# Altium schematic sheet Schemamicro2.SchDoc
size A4; SheetNumber: 2; SheetTotal: 2
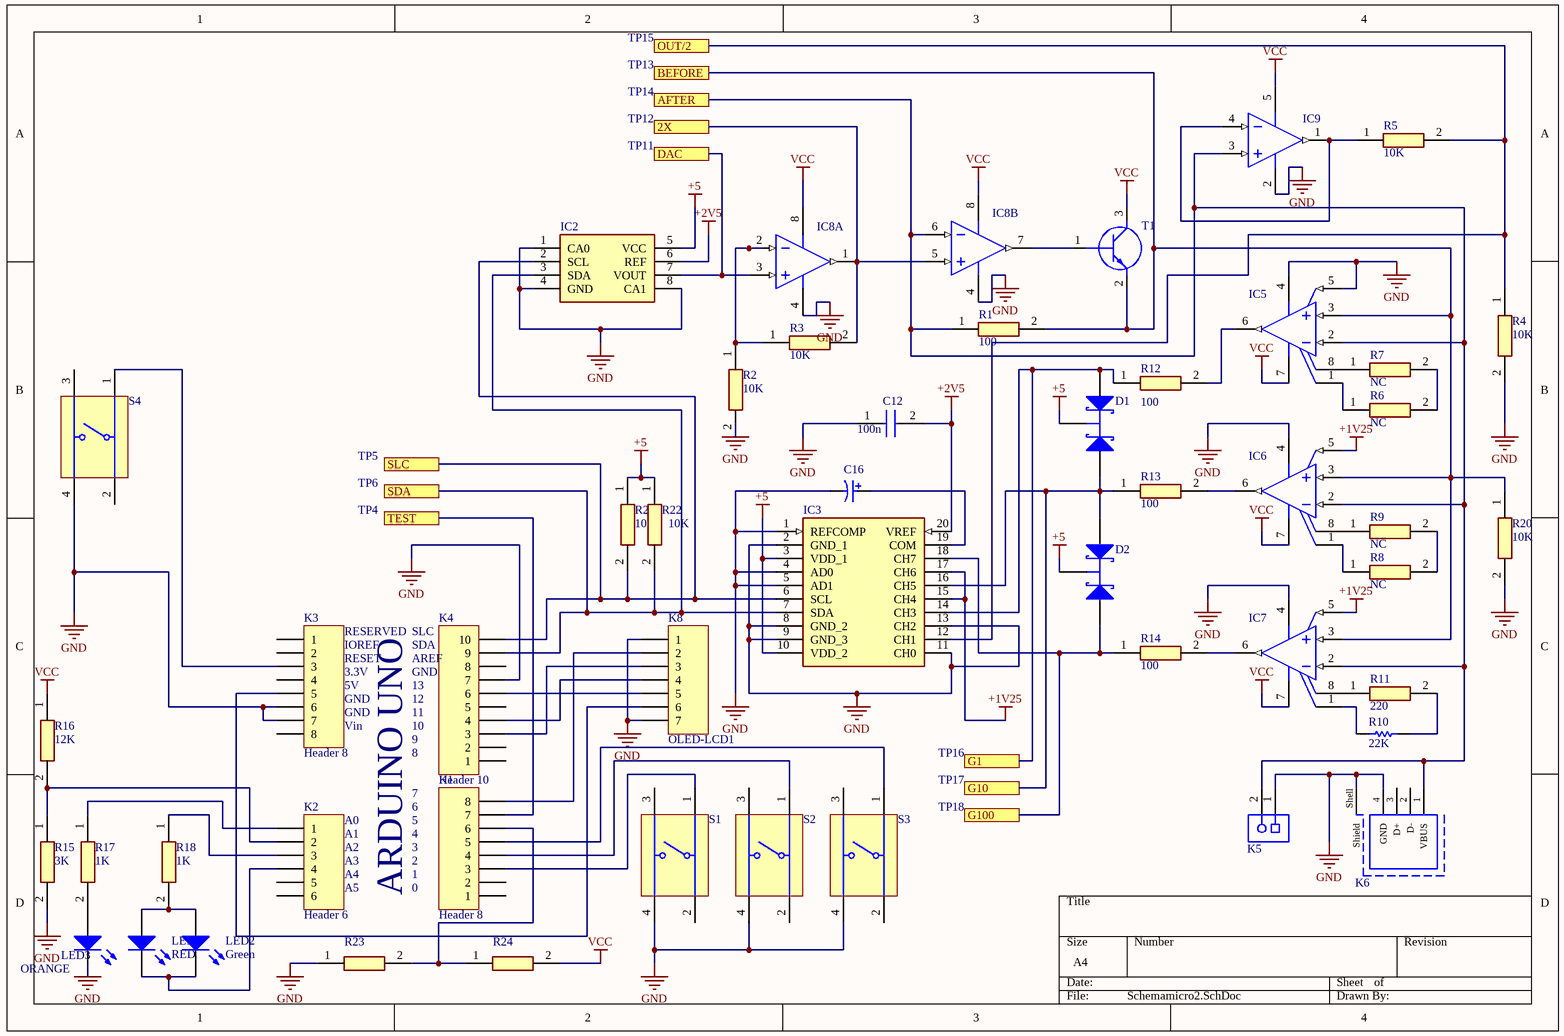
[diagram p0: Schemamicro2.SchDoc]

## Parts
C12  100n  [CAPC2012X90N]
C16  (no value)  [KEMT-T491-B_L]
D1  (no value)  [NXP-SOT23-3_V]
D2  (no value)  [NXP-SOT23-3_V]
IC2  (no value)  [SOT65P280X100-8N]
IC3  (no value)  [SOP65P640X110-20N]
IC5  (no value)  [LT-S8-8_M]
IC6  (no value)  [LT-S8-8_N]
IC7  (no value)  [LT-S8-8_N]
IC8  (no value)  [LT-S8-8_M]  (parts A,B of 2)
IC9  (no value)  [LT-S5-5-TSOT-23_L]
K1  Header 8  [HDR1X8]
K2  Header 6  [HDR1X6]
K3  Header 8  [HDR1X8]
K4  Header 10  [HDR1X10]
K5  (no value)  [PHOE-1729128-2_V]
K6  (no value)  [61400416021]
K8  OLED-LCD1  [HDR1X7]
LED1  RED  [1206_A]
LED2  Green  [1206_A]
LED3  ORANGE  [1206_A]
R1  100  [RESC2012X65N]
R2  10K  [RESC2012X65N]
R3  10K  [RESC2012X65N]
R4  10K  [RESC2012X65N]
R5  10K  [RESC2012X65N]
R6  NC  [RESC2012X65N]
R7  NC  [RESC2012X65N]
R8  NC  [RESC2012X65N]
R9  NC  [RESC2012X65N]
R10  22K  [RESC2013X60X40ML20T25]
R11  220  [RESC2012X65N]
R12  100  [RESC2014X65N]
R13  100  [RESC2014X65N]
R14  100  [RESC2014X65N]
R15  3K  [RESC2014X65N]
R16  12K  [RESC2014X65N]
R17  1K  [RESC2014X65N]
R18  1K  [RESC2014X65N]
R20  10K  [RESC2014X65N]
R21  10K  [RESC2014X65N]
R22  10K  [RESC2014X65N]
R23  (no value)  [RESC2014X65N]
R24  (no value)  [RESC2014X65N]
S1  (no value)  [TECO-1825910-6_V]
S2  (no value)  [TECO-1825910-6_V]
S3  (no value)  [TECO-1825910-6_V]
S4  (no value)  [TECO-1825910-6_V]
T1  (no value)  [SOT95P230X110-3N]

## Ports
2X, AFTER, BEFORE, DAC, G1, G10, G100, OUT/2, SDA, SLC, TEST

## Nets
+1V25: IC3.15(CH4) IC3.17(CH6) IC6.5(REF) IC7.5(REF)
+2V5: C12.2 IC2.6(REF) IC3.20(VREF)
+5: D1.3(K) D2.3(K) IC2.5(VCC) IC3.3(VDD_1) IC3.10(VDD_2) R21.1 R22.1
GND: C12.1 C16.2 IC2.1(CA0) IC2.4(GND) IC2.8(CA1) IC3.1(REFCOMP) IC3.2(GND_1) IC3.4(AD0) IC3.5(AD1) IC3.8(GND_2) IC3.9(GND_3) IC3.11(CH0) IC3.13(CH2) IC5.4(-VS) IC5.5(REF) IC6.4(-VS) IC7.4(-VS) IC8.4(V-) IC9.2(V-) K3.6 K3.7 K4.7 K5.1 K6.4(GND) K6.Shell(Shield) K8.1 K8.7 LED3.1(K) R2.2 R4.2 R15.2 R20.2 R23.1 S1.4 S2.4 S3.4 S4.4
VCC: IC5.7(+VS) IC6.7(+VS) IC7.7(+VS) IC8.8(V+) IC9.5(V+) R16.1 R24.2 T1.3(C)
2X: IC8.1(OUT_A) IC8.5(+IN_B) R3.2 ; port 2X
AFTER: IC5.2(-IN) IC6.2(-IN) IC7.2(-IN) IC8.6(-IN_B) IC9.3(+IN) K5.2 K6.1(VBUS) R1.1 ; port AFTER
BEFORE: IC5.3(+IN) IC6.3(+IN) IC7.3(+IN) R1.2 R20.1 T1.2(E) ; port BEFORE
DAC: IC2.7(VOUT) IC8.3(+IN_A) ; port DAC
G1: D1.2(A) IC3.14(CH3) R12.1 ; port G1
G10: D1.1(A) D2.2(A) IC3.16(CH5) R13.1 ; port G10
G100: D2.1(A) IC3.18(CH7) R14.1 ; port G100
OUT/2: IC3.12(CH1) R4.1 R5.2 ; port OUT/2
SDA: IC2.3(SDA) IC3.7(SDA) K4.9 R22.2 ; port SDA
SLC: IC2.2(SCL) IC3.6(SCL) K4.10 R21.2 ; port SLC
TEST: K1.7 ; port TEST
NetC16_1: C16.1 IC3.19(COM)
NetIC5_1: IC5.1(RG) R6.1
NetIC5_6: IC5.6(OUT) R12.2
NetIC5_8: IC5.8(RG) R7.1
NetIC6_1: IC6.1(RG) R8.1
NetIC6_6: IC6.6(OUT) R13.2
NetIC6_8: IC6.8(RG) R9.1
NetIC7_1: IC7.1(RG) R10.1
NetIC7_6: IC7.6(OUT) R14.2
NetIC7_8: IC7.8(RG) R11.1
NetIC8_2: IC8.2(-IN_A) R2.1 R3.1
NetIC8_7: IC8.7(OUT_B) T1.1(B)
NetIC9_1: IC9.1(OUT) IC9.4(-IN) R5.1
NetK1_3: K1.3 S1.1
NetK1_4: K1.4 S2.1
NetK1_5: K1.5 S3.1
NetK1_6: K1.6 R23.2 R24.1
NetK1_8: K1.8 K8.2
NetK2_1: K2.1 R17.1
NetK2_2: K2.2 R15.1 R16.2
NetK2_3: K2.3 R18.1
NetK2_4: K2.4 LED1.1(K) LED2.1(K)
NetK3_3: K3.3 S4.1
NetK3_5: K3.5 K8.6
NetK4_3: K4.3 K8.3
NetK4_4: K4.4 K8.4
NetK4_6: K4.6 K8.5
NetLED1_2: LED1.2(A) LED2.2(A) R18.2
NetLED3_2: LED3.2(A) R17.2
NetR6_2: R6.2 R7.2
NetR8_2: R8.2 R9.2
NetR10_2: R10.2 R11.2

Not connected (* = marked no-connect by the designer): K1 1 2; K2 5 6; K3 1 2 4 8; K4 1 2 5 8; K6 2(D-) 3(D+); S1 2 3; S2 2 3; S3 2 3; S4 2 3

## Notes on the sheet
- TP15
- TP14
- TP13
- TP11
- TP12
- TP5
- TP6
- TP4
- (near K3) RESERVED
- (near K3) IOREF
- (near K4) SLC
- (near K4) SDA
- (near K3) RESET
- (near K3) 3.3V
- (near K3) 5V
- (near K3) GND
- (near K4) AREF
- (near K4) GND
- 13
- 12
- 11
- (near K3) Vin
- 10
- 9
- 8
- TP16
- TP17
- (near K2) A0
- (near K2) A1
- (near K2) A2
- 7
- 6
- 5
- 4
- 3
- TP18
- (near K2) A3
- (near K2) A4
- (near K2) A5
- ARDUINO UNO
- 2
- 1
- 0

## Library data of the parts
C12 = MC0805B104K500CT: Capacitor; Manufacturer_Name: MULTICOMP; Datasheet Link: https://componentsearchengine.com/Datasheets/2/MC0805B104K500CT.pdf; Height: 0.9mm; Manufacturer_Part_Number: MC0805B104K500CT
C16 = CMP-2000-07192-1: Tantalum Surface Mount Capacitor, 10 uF, +/- 20%, 16 V, -55 to 125 degC, 2-Pin SMD, RoHS, Tape and Reel; Manufacturer: Kemet; DF: 6%; Product Diameter (mm): NotRequiredmm; ESR: 2.8ohm; Capacitance: 10000000pF; Insulation: NotRequired; Rad Hardened: No; Polarity: Polar; Case Style: Molded; Product Depth (mm): 2.8mm; Product Length (mm): 3.5mm; Voltage: 16VDC; DCL: 1.6uA; Product Height (mm): 1.9mm; Mounting Technology: SurfaceMount; Package Reference: T491-B; Datasheet URL: http://www.kemet.com/Lists/ProductCatalog/Attachments/254/KEM_T2005_T491.pdf; Construction: SMTChip; Package / Case: 3528-21; Length W/Weld: NotRequiredmm; Seated Plane Height: NotRequiredmm; Datasheet Version: 06/2016; Seal: NotRequired; Mounting Style: SurfaceMount; Failure Rate: NotRequired; Operating Temp Range: -55Cto125C; Manufacturer URL: http://www.kemet.com/; Tolerance (+ or -): 20%; Case Code: B; Packaging: TapeandReel; Lead Spacing (nom): NotRequiredmm; Length W/Weld (max): NotRequiredmm; Package Description: 2-Pin Surface Mount Device, Body 3.5 x 2.8 mm; Wire Form: NotRequired
D1 D2 = CMP-0417-00003-1: Schottky Barrier Diode, 30 V, 2 uA, -55 to 150 degC, 3-Pin SOT23, RoHS, Tape and Reel; PartNumber: BAT54C; Manufacturer: NXP Semiconductors; IR (uA): 2; VF (mV): 800; Trr (ns): 5; Cd (pF): 10; VR (V): 30; Rth(j-a) (K/W): 500; RoHS: TRUE; Packing: Tape and Reel; ComponentLink2URL: http://www.nxp.com/documents/data_sheet/BAT54_SER.pdf; ComponentLink2Description: Datasheet; Temperature Range: -55 to 150 degC; PackageReference: SOT23-3; PackageDescription: 3-Pin Plastic Surface-mounted Package, Body 1.3 x 2.9 mm, Pitch 0.95 mm; Mounting Technology: Surface Mount; ComponentLink1URL: http://www.nxp.com/; DatasheetVersion: Rev. 5; ComponentLink1Description: Manufacturer URL
IC2 = LTC2631CTS8-LZ12#TRMPBF: Integrated Circuit; Manufacturer_Name: Analog Devices; Datasheet Link: https://www.analog.com/media/en/technical-documentation/data-sheets/2631fd.pdf; Height: 1mm; Manufacturer_Part_Number: LTC2631CTS8-LZ12#TRMPBF; Mouser Part Number: 584-2631CTS8LZ12TMPF; Mouser Price/Stock: https://www.mouser.co.uk/ProductDetail/Analog-Devices/LTC2631CTS8-LZ12TRMPBF/?qs=hVkxg5c3xu%252BAZArayp8N8g%3D%3D; Arrow Part Number: LTC2631CTS8-LZ12#TRMPBF; Arrow Price/Stock: https://www.arrow.com/en/products/ltc2631cts8-lz12trmpbf/analog-devices
IC3 = LTC2309CF#PBF: Integrated Circuit; Manufacturer_Name: Linear Technology; Datasheet Link: http://docs-emea.rs-online.com/webdocs/10c2/0900766b810c2cad.pdf; Height: 1.1mm; Manufacturer_Part_Number: LTC2309CF#PBF; Mouser Part Number: 584-LTC2309CF#PBF; Mouser Price/Stock: https://www.mouser.com/Search/Refine.aspx?Keyword=584-LTC2309CF%23PBF; Arrow Part Number: LTC2309CF#PBF; Arrow Price/Stock: https://www.arrow.com/en/products/ltc2309cfpbf/linear-technology
IC5 = CMP-0359-03660-2: Single Channel, Micropower, Single Supply Rail-to-Rail Output Instrumentation Amplifiers, 0.06 MHz Typical GBW, 0.026 V/us Typical SR, 2.2 to 36 V, 8-Pin SOIC (S8-8), Commercial, Pb-Free; Manufacturer: Linear Technology; PartNumber: LT1789CS8-1#PBF; Linear Technology Part Number: LT1789-1; Vos (mV) Typical: 0.15; Vs Max (V): 36; Vos (mV) Guaranteed: 0.75; Is (mA) Typical: 0.067; SR (V/us) Typical: 0.026; Vs Min (V): 2.2; Channels (#): 1; GBW (MHz) Typical: 0.06; PackageVersion: Rev G; ComponentLink1URL: http://www.linear.com/; ComponentLink2URL: http://cds.linear.com/docs/en/datasheet/1789fc.pdf; RoHS: Pb-Free; Mounting Technology: Surface Mount; RevisionNote: URLs updated; ComponentLink3URL: http://cds.linear.com/docs/en/packaging/05081610_G_SO8.pdf; DatasheetVersion: Rev. C; ComponentLink3Description: Package Specification; ComponentLink2Description: Datasheet; ComponentLink1Description: Manufacturer URL; Type: IA; PackageDescription: 8-Pin Plastic Small Outline, Body 4.9 x 3.9 mm, Pitch 1.27 mm; PackageReference: LT-S8-8
IC6 IC7 = CMP-0359-03644-3: Single Channel, Micropower, Single Supply Rail-to-Rail Output Instrumentation Amplifiers, 0.06 MHz Typical GBW, 0.026 V/us Typical SR, 2.2 to 36 V, 8-Pin SOIC (S8-8), Commercial, Pb-Free; PartNumber: LT1789CS8-10#PBF; Manufacturer: Linear Technology; Linear Technology Part Number: LT1789-10; Vos (mV) Typical: 0.65; SR (V/us) Typical: 0.026; GBW (MHz) Typical: 0.06; Channels (#): 1; Is (mA) Typical: 0.067; Vs Max (V): 36; Vos (mV) Guaranteed: 3; Vs Min (V): 2.2; PackageDescription: 8-Pin Plastic Small Outline, Body 4.9 x 3.9 mm, Pitch 1.27 mm; Mounting Technology: Surface Mount; ComponentLink1URL: http://www.linear.com/; DatasheetVersion: Rev. C; ComponentLink2Description: Datasheet; RoHS: Pb-Free; ComponentLink3Description: Package Specification; Type: IA; PackageReference: LT-S8-8; RevisionNote: URLs updated; ComponentLink1Description: Manufacturer URL; ComponentLink2URL: http://cds.linear.com/docs/en/datasheet/1789fc.pdf; ComponentLink3URL: http://cds.linear.com/docs/en/packaging/05081610_G_SO8.pdf; PackageVersion: Rev G
IC8 = CMP-0359-02698-2: Dual Channel, Low Noise, CMOS Operational Amplifier, RRO, 18 MHz Typical GBW, 10 V/us Typical SR, 2.8 to 12 V, 8-Pin SOIC (S8-8), Commercial, Pb-Free; Linear Technology Part Number: LTC6241HV; PartNumber: LTC6241HVCS8#PBF; Manufacturer: Linear Technology; SR (V/us) Typical: 10; Vs Min (V): 2.8; Is (mA) Typical: 1.8; Channels (#): 2; GBW (MHz) Typical: 18; Vos (mV) Typical: 0.04; Vs Max (V): 12; Type: VFB; RoHS: Pb-Free; ComponentLink3Description: Package Specification; DatasheetVersion: Rev. E; ComponentLink1Description: Manufacturer URL; RevisionNote: URLs updated; ComponentLink2Description: Datasheet; ComponentLink3URL: http://cds.linear.com/docs/en/packaging/05081610_G_SO8.pdf; Mounting Technology: Surface Mount; PackageDescription: 8-Pin Plastic Small Outline, Body 4.9 x 3.9 mm, Pitch 1.27 mm; PackageVersion: Rev G; ComponentLink2URL: http://cds.linear.com/docs/en/datasheet/624012fe.pdf; PackageReference: LT-S8-8; ComponentLink1URL: http://www.linear.com/
IC9 = CMP-0359-02161-2: Single Channel, Micropower Zero-Drift Operational Amplifier, 0.5 MHz Typical GBW, 0.5 V/us Typical SR, 2.7 to 11 V, 5-Pin SOT23 (S5-5), Commercial, Pb-Free, Mini Reel; PartNumber: LTC2054HVCS5#TRMPBF; Linear Technology Part Number: LTC2054HV; Manufacturer: Linear Technology; Vs Min (V): 2.7; Vos (mV) Typical: 0.0005; SR (V/us) Typical: 0.5; Channels (#): 1; Vs Max (V): 11; Is (mA) Typical: 0.15; ComponentLink1URL: http://www.linear.com/; ComponentLink1Description: Manufacturer URL; Packing: Mini Reel; PackageReference: LT-S5-5-TSOT-23; ComponentLink3URL: http://cds.linear.com/docs/en/packaging/SOT_5_05-08-1635.pdf; Type: ZD; PackageDescription: 5-Lead Plastic TSOT-23, Body 1.63 x 2.90 mm, Pitch 0.95 mm; RoHS: Pb-Free; RevisionNote: URLs updated; ComponentLink2URL: http://cds.linear.com/docs/en/datasheet/20545fc.pdf; Code_JEDEC: MO-193; GBW (MHz) Typical: 0.5; DatasheetVersion: Rev. C; Mounting Technology: Surface Mount; ComponentLink2Description: Datasheet; ComponentLink3Description: Package Specification
K1 K3 = Header 8: Header, 8-Pin; LatestRevisionDate: 17-Jul-2002; LatestRevisionNote: Re-released for DXP Platform.; Publisher: Altium Limited
K2 = Header 6: Header, 6-Pin; LatestRevisionDate: 17-Jul-2002; LatestRevisionNote: Re-released for DXP Platform.; Publisher: Altium Limited
K4 = Header 10: Header, 10-Pin; LatestRevisionDate: 17-Jul-2002; LatestRevisionNote: Re-released for DXP Platform.; Publisher: Altium Limited
K5 = CMP-2000-05815-1: PCB Terminal Block, 13.5 A, 400 V, 2-Pin THD, RoHS, Bulk; PartNumber: 1729128; Manufacturer: Phoenix Contact; Package Version: 03/2015; No. of Rows: 1; Pitch: 5.08mm; No. of Positions: 2; Voltage Rating: 400V; Current Rating: 13500mA; Manufacturer URL: http://www.phoenixcontact.com/; Datasheet URL: https://datasheet.ciiva.com/16046/1729128-16046181.pdf; RoHS: TRUE; Package URL: https://www.phoenixcontact.com/online/portal/pi/pxc/product_detail_page/!ut/p/b1/3VdJjqNKFDxLH8AFycySyWY2ozFsEPOMMQaDOX1XedGL_1Vdm5YXJleknhSKeBkvI6EA8ncAo3AYoDhBQGco6KN7VURTdemj9us_IEKEZo_YHiPAEWEFmDGOHMORkqKYCORBZxgL7ZoaZYcbFFUZ3fqxSY6GOuxydWUuHqz1ynmMFygu583Bob0Ewr6Sd_l-5m-kAueHiB0jpRwZwe58wwtkpxtMYd_LmGcDRU02dRNEyWt6Y2ti5pSyJ_reIkzIulrqApdnbT11V5jnCKbYNCvhEM1MCpPByat_X379-iThf08CI5GfOPqfBeS3BRoBOdD55AKVv0iLwCMq-2BrzXWSGRH7pUGD9uwXQjiph3xL0DKQwdGa0JImiIOmBNOestqgwTHSSs2oOep-78apyXQBvNi8ZLaFjvjWvcaUEBu0MC6Wbe-d6mB0FAebo2lUWinqYaZs5DAYzV0RP9yitUjnGJ0iI9xhZkT42OCQNUJJhkgWINNQLP2JFP6OpMg3JCVg70jqHT0lvKOnhHf0lPuOnnLf0VPuWx6_dxwUIvwk5WMkT0kLL1mh61l2yZVSzG3pYV_bqo-mj6uMKwKwdnnW8Jh5RTOJzMOA5c-eJDaZQw4mTMPH02PvS_ZAqNVjVTo2WyYLkwH_KU1mmmG5kjRhDqPXLwwVHvVOjCM60-fpXvTDfMGW1PVFVS1r4e4yVDk4ZdNbkUHvqPqQSeian4UD39fNKmachqdJ1NJbyk8rXT9mXTvPk3oE5meulKGgiruPJek-4I9hTT6G8ZLOyRSm2RRVbThERQad5OS28hdt4YW4vG0stgYYzsWsK4_7y6DZMjJSCqri1kyiZR5vD7pwIrNR7QwPHTcLTI5qT7eRlpHrdGiupYlqQDJ7zy_CND8fWWBoLRXxk1RVcXiBQwbTD4Xi7KL-FuO94t9xaqweXzH; Package Description: 2-Pin Through Hole Device, Body 8.1 x 10.16 mm, Pitch 5.08 mm; Datasheet Version: 12/2013; Mounting Technology: ThroughHole; Orientation: Horizontal; Package Reference: 1729128-2; Packing: Bulk
K6 = CMP-1502-03227-1: USB 2.0 Type A Receptacle WR-COM, Horizontal, THT; Manufacturer: Wurth Elektronik; Working Voltage: 30VAC; Rated Current: 1.5A; Contact Resistance: 20mOhm; Manufacturer URL: http://www.we-online.de; Publisher: WurthElektronik; Packaging: Tray; Operating Temperature: -40to105degC; Orientation: Horizontal; Mounting Technology: THT; Part Number: 61400416021; Gender: Receptacle; Package Reference: 61400416021; Connector Type: USB2.0TypeA; Datasheet URL: https://katalog.we-online.de/em/datasheet/61400416021.pdf
K8 = Header 7: Header, 7-Pin; LatestRevisionDate: 17-Jul-2002; LatestRevisionNote: Re-released for DXP Platform.; Publisher: Altium Limited
LED1 = CMP-1426-00013-1: SMD mono-color Chip LED, WL-SMCW, Red; PartNumber: 150120RS75000; Manufacturer: Wuerth Elektronik; Color: Red; ComponentLink2URL: http://katalog.we-online.com/led/datasheet/150120RS75000.pdf; ComponentLink2Description: Datasheet; ComponentLink1Description: Manufacturer URL; ComponentLink1URL: http://www.we-online.com; PackageReference: 1206_A
LED2 = CMP-1426-00014-1: SMD mono-color Chip LED, WL-SMCW, Green; Manufacturer: Wuerth Elektronik; PartNumber: 150120GS75000; PackageReference: 1206_A; ComponentLink1Description: Manufacturer URL; ComponentLink2URL: http://katalog.we-online.com/led/datasheet/150120GS75000.pdf; ComponentLink2Description: Datasheet; Color: Green; ComponentLink1URL: http://www.we-online.com
LED3 = CMP-1426-00019-1: SMD mono-color Chip LED, WL-SMCW, Yellow; PartNumber: 150120YS75000; Manufacturer: Wuerth Elektronik; ComponentLink2URL: http://katalog.we-online.com/led/datasheet/150120YS75000.pdf; ComponentLink1URL: http://www.we-online.com; Color: Yellow; ComponentLink1Description: Manufacturer URL; PackageReference: 1206_A; ComponentLink2Description: Datasheet
R1 R6-R9 = MCTC0525B1000T5E: Resistor; Manufacturer_Name: MULTICOMP; Datasheet Link: https://componentsearchengine.com/Datasheets/2/MCTC0525B1001T5E.pdf; Height: 0.65mm; Manufacturer_Part_Number: MCTC0525B1000T5E
R2-R5 = MCTC0525B1002T5E: Resistor; Manufacturer_Name: MULTICOMP; Datasheet Link: https://componentsearchengine.com/Datasheets/2/MCTC0525B1001T5E.pdf; Height: 0.65mm; Manufacturer_Part_Number: MCTC0525B1002T5E
R10 = CMP-2001-00614-1: Manufacturer: Panasonic; Part Number: ERA6AEB223V
R11 = MCTC0525B1000T5E: Resistor 220 ohm; Manufacturer_Name: MULTICOMP; Datasheet Link: https://componentsearchengine.com/Datasheets/2/MCTC0525B1001T5E.pdf; Height: 0.65mm; Manufacturer_Part_Number: MCTC0525B1000T5E
R12-R14 = MC01W08055100R: Resistor; Manufacturer_Name: MULTICOMP; Datasheet Link: http://www.farnell.com/datasheets/1729047.pdf; Height: 0.65mm; Manufacturer_Part_Number: MC01W08055100R
R15 R16 = MC01W0805512K: Resistor; Manufacturer_Name: MULTICOMP; Datasheet Link: http://www.farnell.com/datasheets/1729047.pdf; Height: 0.65mm; Manufacturer_Part_Number: MC01W0805512K
R17 R18 = MC01W080551K: Resistor 1K ohm; Manufacturer_Name: MULTICOMP; Datasheet Link: http://www.farnell.com/datasheets/1729047.pdf; Height: 0.65mm; Manufacturer_Part_Number: MC01W080551K
R20-R24 = MC01W0805510K: Resistor; Manufacturer_Name: MULTICOMP; Datasheet Link: http://www.farnell.com/datasheets/1729047.pdf; Height: 0.65mm; Manufacturer_Part_Number: MC01W0805510K
S1-S4 = CMP-1684-00021-1: Tact Switch, SPST-NO, 0.05 A, -35 to 85 degC, 4-Pin THD, RoHS, Bulk; Part No: 1825910-6; Manufacturer: TE Connectivity; Maximum Contact Resistance: 100mOhm; Mechanical Life: 100000Cycles; Bushing Type: Unthreaded; Switch Configuration: OFF(ON); Maximum DC Voltage Rating: 24V; Contact Rating @ Voltage: 0.05A@24VDC; Actuator Color: Black; Body Orientation: Straight; Function: MomentaryContact; Illumination: N/R; Actuator Style: RoundButton; Actuator Material: PolybutyleneTerephthalate; Dielectric Strength: 500VAC; Pole Throw Configuration: SPST; Actuator Length: 1.4mm; Product Weight: N/A; Contact Material: CopperAlloy; Housing Material: N/A; Terminal Type: PCPins; Minimum Insulation Resistance: 100MOhm; Package Description: 4-Pin Through Hole Device, Body 5.99 x 5.99 mm, Pitch 6.5 mm; Package Reference: THD; Base Material: N/A; Manufacturer URL: http://www.te.com; Contact Plating: Silver; RoHS: Yes; Datasheet Version: Rev. C9; Electrical Life: 100000Cycles; Maximum AC Voltage Rating: N/A; Thread Size: N/R; Operating Temperature: -35to85C; Mounting: ThroughHole; Dimension: 5.99x5mm; Datasheet URL: http://www.te.com/commerce/DocumentDelivery/DDEController?Action=showdoc&DocId=Customer+Drawing%7F1825910%7FC9%7Fpdf%7FEnglish%7FENG_CD_1825910_C9.pdf%7F1825910-6; Family: 1825910; Seal Location: N/A; Seal Description: N/A; Packaging: N/A
T1 = BC847C_AU,215: Transistor BJT NPN; Manufacturer_Name: Nexperia; Manufacturer_Part_Number: BC847C/AU,215; Datasheet Link: http://assets.nexperia.com/documents/data-sheet/BC847_SER.pdf; Height: 1.1mm